# EAGLE design lodev-s76s (EAGLE 9.3.1)

## Sheet 1 of 2
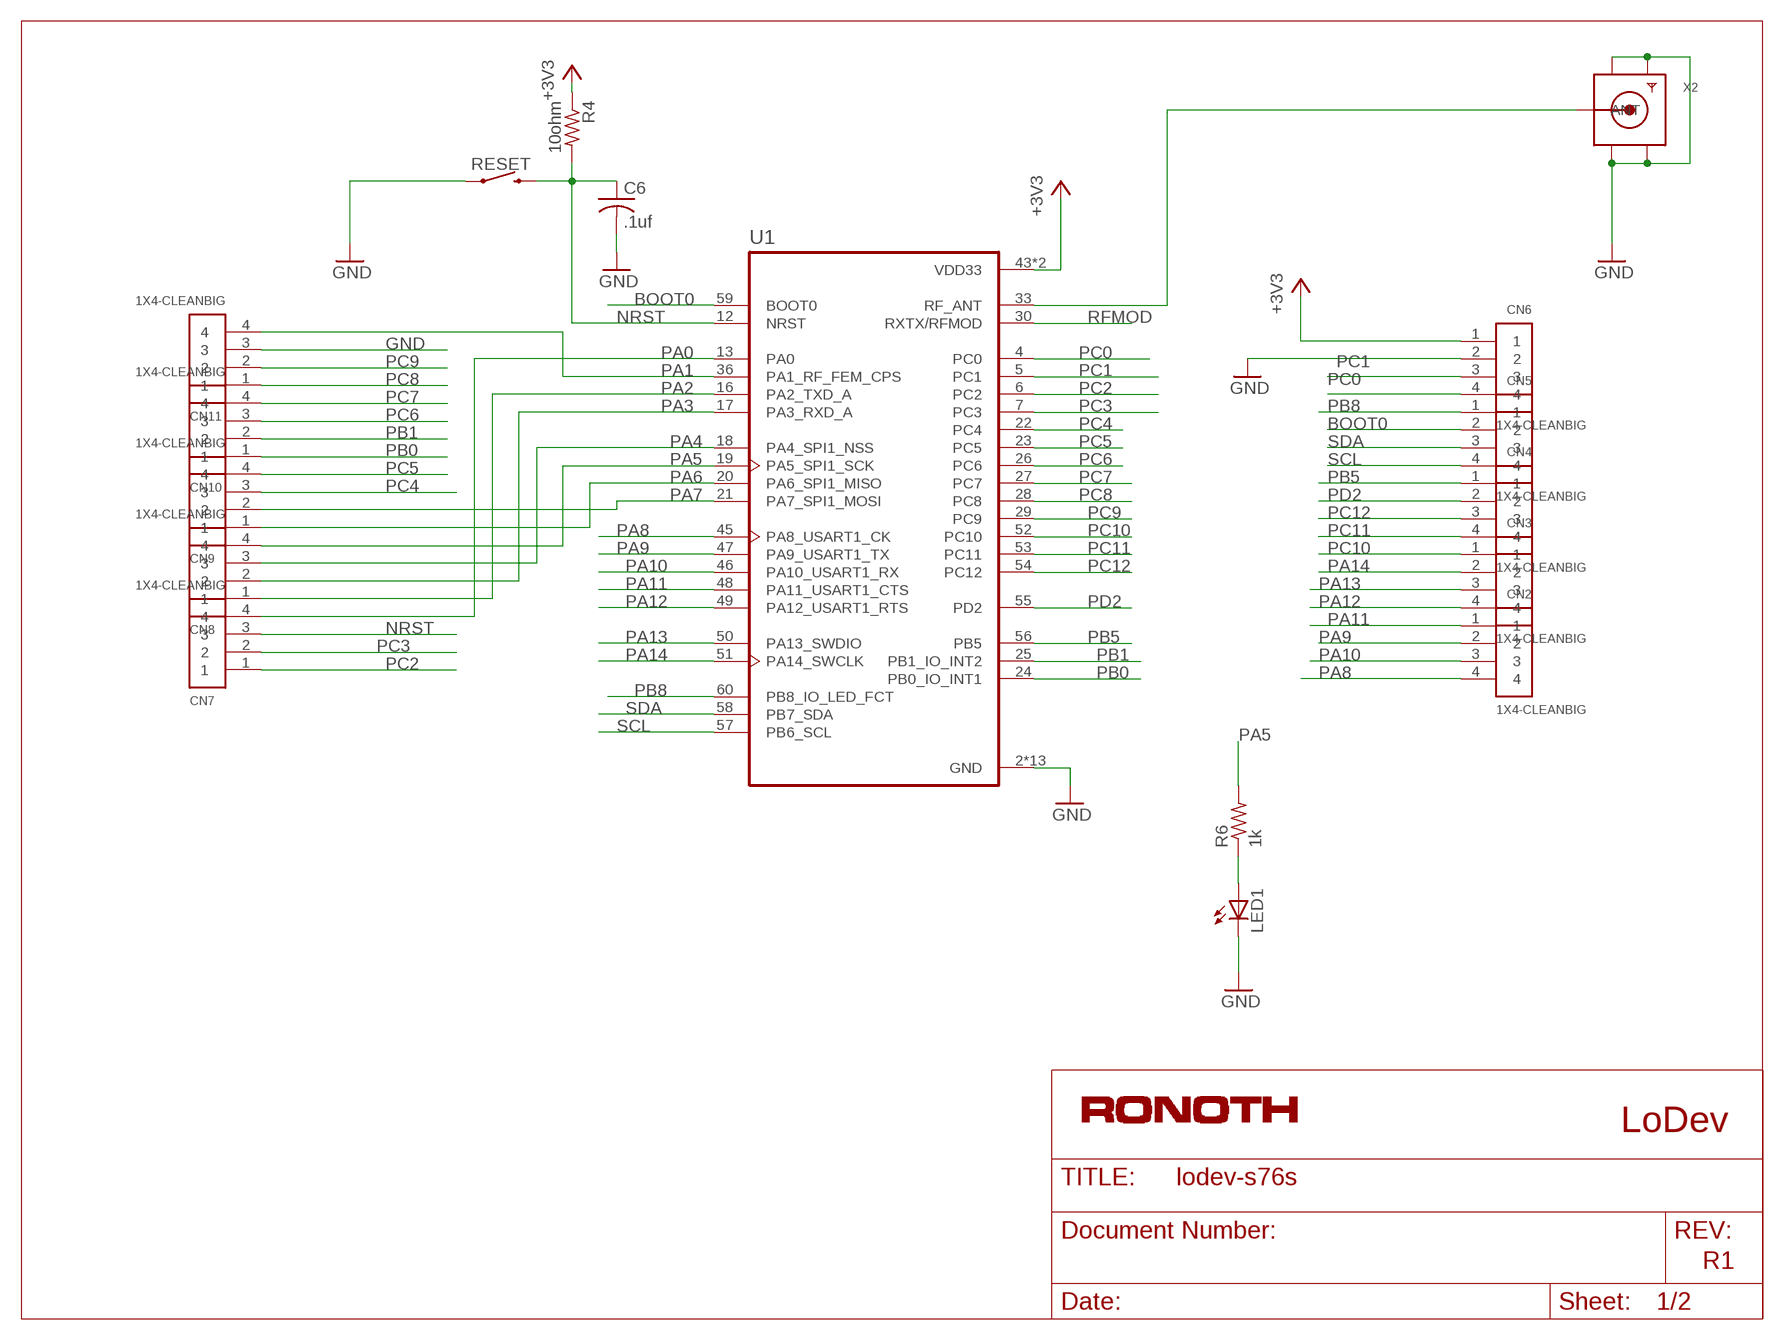
[diagram p0: schematic, sheet 1]

### Parts
C6  .1uf  C-USC0603K  [C0603K]
CN2  1X4-CLEANBIG  [1X04-CLEANBIG]
CN3  1X4-CLEANBIG  [1X04-CLEANBIG]
CN4  1X4-CLEANBIG  [1X04-CLEANBIG]
CN5  1X4-CLEANBIG  [1X04-CLEANBIG]
CN6  1X4-CLEANBIG  [1X04-CLEANBIG]
CN7  1X4-CLEANBIG  [1X04-CLEANBIG]
CN8  1X4-CLEANBIG  [1X04-CLEANBIG]
CN9  1X4-CLEANBIG  [1X04-CLEANBIG]
CN10  1X4-CLEANBIG  [1X04-CLEANBIG]
CN11  1X4-CLEANBIG  [1X04-CLEANBIG]
LED1  LEDCHIPLED_0603  [CHIPLED_0603]
R4  10ohm  R-US_R0603  [R0603]
R6  1k  R-US_R0603  [R0603]
RESET  MOMENTARY-SWITCH-SPST-SMD-6.0X3.5MM  [TACTILE_SWITCH_SMD_6.0X3.5MM]
U1  S76S  [ACSIP_S76S]
X2  SMACONNECTOR_EDGE  [SMA_EDGELAUNCH]

### Nets
+3V3: CN6.1 R4.1 U1.43(VDD33) U1.44(VDD33) ; also sheet 2
BOOT0: CN5.2 U1.59(BOOT0)
GND: C6.2 CN6.2 CN11.3 LED1.C RESET.1 U1.2(GND) U1.3(GND) U1.14(GND) U1.15(GND) U1.31(GND) U1.32(GND) U1.34(GND) U1.35(GND) U1.37(GND) U1.39(GND) U1.41(GND) U1.61(GND) U1.62(GND) X2.GND@1(GND4) X2.GND@2(GND3) X2.GND@3(GND2) X2.GND@4(GND1) ; also sheet 2
N$3: U1.33(RF_ANT) X2.P(ANT)
N$4: LED1.A R6.1
NRST: C6.1 CN7.3 R4.2 RESET.2 U1.12(NRST)
PA0: CN7.4 U1.13(PA0)
PA1: CN11.4 U1.36(PA1_RF_FEM_CPS)
PA2: CN8.1 U1.16(PA2_TXD_A)
PA3: CN8.2 U1.17(PA3_RXD_A)
PA4: CN8.3 U1.18(PA4_SPI1_NSS)
PA5: CN8.4 R6.2 U1.19(PA5_SPI1_SCK)
PA6: CN9.1 U1.20(PA6_SPI1_MISO)
PA7: CN9.2 U1.21(PA7_SPI1_MOSI)
PA8: CN2.4 U1.45(PA8_USART1_CK)
PA9: CN2.2 U1.47(PA9_USART1_TX) ; also sheet 2
PA10: CN2.3 U1.46(PA10_USART1_RX) ; also sheet 2
PA11: CN2.1 U1.48(PA11_USART1_CTS)
PA12: CN3.4 U1.49(PA12_USART1_RTS)
PA13: CN3.3 U1.50(PA13_SWDIO)
PA14: CN3.2 U1.51(PA14_SWCLK)
PB0: CN10.1 U1.24(PB0_IO_INT1)
PB1: CN10.2 U1.25(PB1_IO_INT2)
PB5: CN4.1 U1.56(PB5)
PB8: CN5.1 U1.60(PB8_IO_LED_FCT)
PC0: CN6.4 U1.4(PC0)
PC1: CN6.3 U1.5(PC1)
PC2: CN7.1 U1.6(PC2)
PC3: CN7.2 U1.7(PC3)
PC4: CN9.3 U1.22(PC4)
PC5: CN9.4 U1.23(PC5)
PC6: CN10.3 U1.26(PC6)
PC7: CN10.4 U1.27(PC7)
PC8: CN11.1 U1.28(PC8)
PC9: CN11.2 U1.29(PC9)
PC10: CN3.1 U1.52(PC10)
PC11: CN4.4 U1.53(PC11)
PC12: CN4.3 U1.54(PC12)
PD2: CN4.2 U1.55(PD2)
RFMOD: U1.30(RXTX/RFMOD)
SCL: CN5.4 U1.57(PB6_SCL)
SDA: CN5.3 U1.58(PB7_SDA)

### Notes on the sheet
- LoDev
- R1

## Sheet 2 of 2
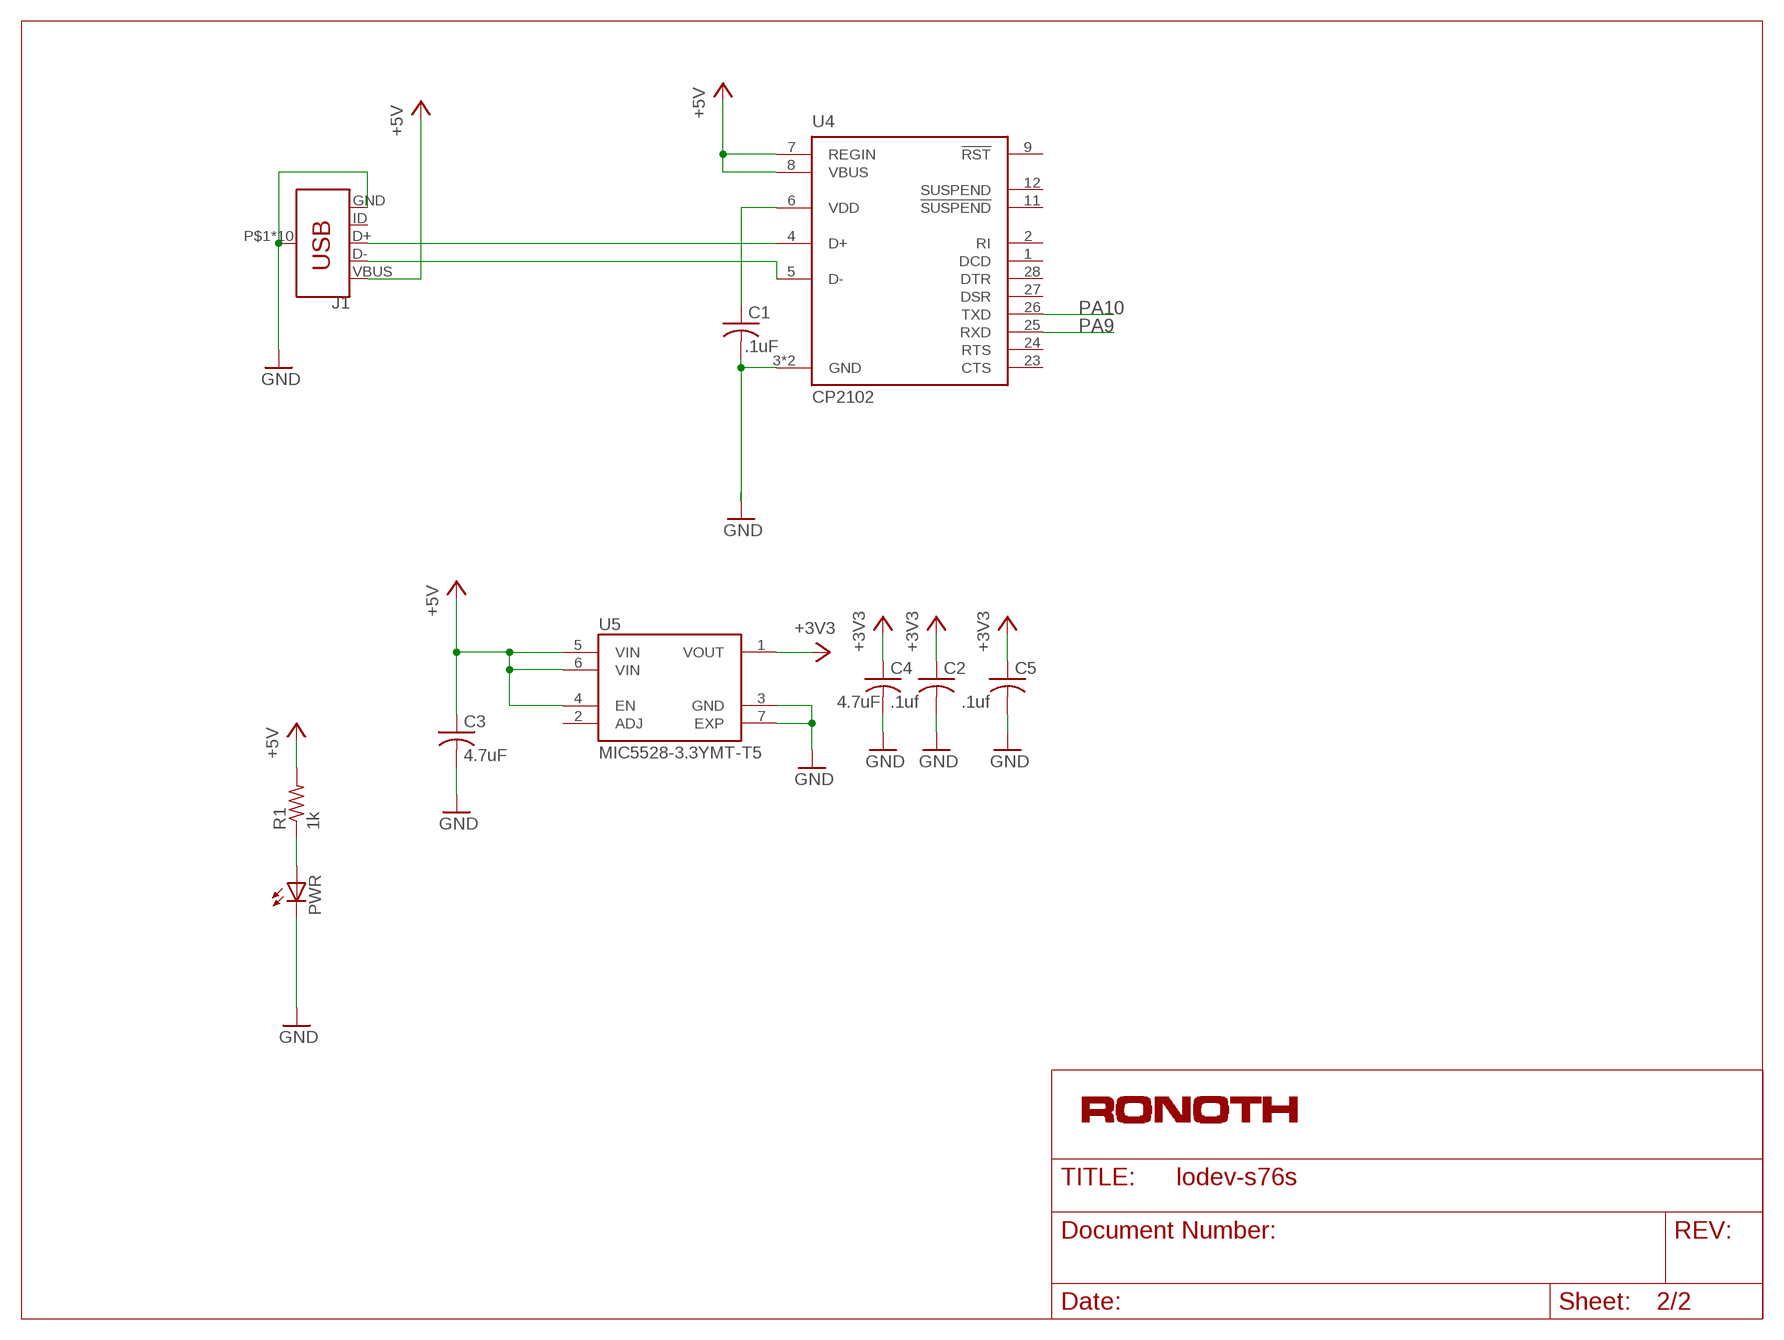
[diagram p1: schematic, sheet 2]

### Parts
C1  .1uF  C-USC0603K  [C0603K]
C2  .1uf  C-USC0603K  [C0603K]
C3  4.7uF  C-USC0603K  [C0603K]
C4  4.7uF  C-USC0603K  [C0603K]
C5  .1uf  C-USC0603K  [C0603K]
J1  USB_MICRO-B  [USB-MICROB-PTH]
PWR  LEDCHIPLED_0603  [CHIPLED_0603]
R1  1k  R-US_R0603  [R0603]
U4  CP2102  [MLP28]
U5  MIC5528-3.3YMT-T5  MIC94325YMT-TR  [SON50P160X160X60-7N]

### Nets
+3V3: C2.1 C4.1 C5.1 U5.1(VOUT) ; also sheet 1
+5V: C3.1 J1.VBUS R1.2 U4.7(REGIN) U4.8(VBUS) U5.4(EN) U5.5(VIN) U5.6(VIN)
D+: J1.D+ U4.4(D+)
D-: J1.D- U4.5(D-)
GND: C1.2 C2.2 C3.2 C4.2 C5.2 J1.GND J1.P$1(SHIELD) J1.P$3(SHIELD) J1.P$4(SHIELD) J1.P$8(SHIELD) J1.P$10(SHIELD) J1.P$12(SHIELD) J1.SHEILD2(SHIELD) J1.SHIELD J1.SHIELD3(SHIELD) J1.SHIELD4(SHIELD) PWR.C U4.3(GND) U4.EXP(GND) U5.3(GND) U5.7(EXP) ; also sheet 1
N$1: PWR.A R1.1
N$5: C1.1 U4.6(VDD)
PA9: U4.25(RXD) ; also sheet 1
PA10: U4.26(TXD) ; also sheet 1
Unconnected: J1.ID U4.1(DCD) U4.2(RI) U4.9(!RST) U4.11(!SUSPEND) U4.12(SUSPEND) U4.23(CTS) U4.24(RTS) U4.27(DSR) U4.28(DTR) U5.2(ADJ)

## Library data of the parts
C1-C6 = adafruit:C-US: CAPACITOR, American symbol
CN2-CN11 = adafruit:1X4: 4-pin connector
J1 = bitsetters:USB_MICRO-B: USB Type Micro-B Connector Male/female and PTH/SMT variants SparkFun Products: SparkFun microB USB Breakout <https://www.sparkfun.com/products/12035> SparkFun USB microB Plug Breakout <https://www.sparkfun.com/products/10031> SparkFun ESP8266 Thing <https://www.sparkfun.com/products/13231>
LED1 PWR = adafruit:LED: LED OSRAM: - CHIPLED LG R971, LG N971, LY N971, LG Q971, LY Q971, LO R971, LY R971 LH N974, LH R974 LS Q976, LO Q976, LY Q976 LO Q996 - Hyper CHIPLED LW Q18S LB Q993, LB Q99A, LB R99A - SideLED LS A670, LO A670, LY A670, LG A670, LP A670 LB A673, LV A673, LT A673, LW A673 LH A674 LY A675 LS A676, LA A676, LO A676, LY A676, LW A676 LS A679, LY A679, LG A679 - Hyper Micro SIDELED® LS Y876, LA Y876, LO Y876, LY Y876 LT Y87S - SmartLED LW L88C, LW L88S LB L89C, LB L89S, LG L890 LS L89K, LO L89K, LY L89K LS L896, LA L896, LO L896, LY L896 - TOPLED LS T670, LO T670, LY T670, LG T670, LP T670 LSG T670, LSP T670, LSY T670, LOP T670, LYG T670 LG T671, LOG T671, LSG T671 LB T673, LV T673, LT T673, LW T673 LH T674 LS T676, LA T676, LO T676, LY T676, LB T676, LH T676, LSB T676, LW T676 LB T67C, LV T67C, LT T67C, LS T67K, LO T67K, LY T67K, LW E67C LS E67B, LA E67B, LO E67B, LY E67B, LB E67C, LV E67C, LT E67C LW T67C LS T679, LY T679, LG T679 LS T770, LO T770, LY T770, LG T770, LP T770 LB T773, LV T773, LT T773, LW T773 LH T774 LS E675, LA E675, LY E675, LS T675 LS T776, LA T776, LO T776, LY T776, LB T776 LHGB T686 LT T68C, LB T68C - Hyper Mini TOPLED® LB M676 - Mini TOPLED Santana® LG M470 LS M47K, LO M47K, LY M47K Source: http://www.osram.convergy.de/
R1 R4 R6 = adafruit:R-US_: RESISTOR, American symbol
RESET = SparkFun-Switches:MOMENTARY-SWITCH-SPST: Momentary Switch (Pushbutton) - SPST Normally-open (NO) SPST momentary switches (buttons, pushbuttons). Variants PTH-12MM - 12mm square, through-hole Momentary Pushbutton Switch - 12mm Square <https://www.sparkfun.com/products/9190> (COM-09190) PTH-6.0MM, PTH-6.0MM-KIT - 6.0mm square, through-hole Mini Pushbutton Switch <https://www.sparkfun.com/products/97> (COM-00097) KIT package intended for soldering kit's - only one side of pads' copper is exposed. PTH-RIGHT-ANGLE-KIT - Right-angle, through-hole Right Angle Tactile Button <https://www.sparkfun.com/products/10791> - Used on SparkFun BigTime Watch Kit <https://www.sparkfun.com/products/11734> SMD-12MM - 12mm square, surface-mount Tactile Button - SMD (12mm) <https://www.sparkfun.com/products/12993> (COM-12993) Used on SparkFun PicoBoard <https://www.sparkfun.com/products/11888> SMD-4.5MM - 4.5mm Square Trackball Switch Used on SparkFun Blackberry Trackballer Breakout <https://www.sparkfun.com/products/13169> SMD-4.6MMX2.8MM - 4.60mm x 2.80mm, surface mount Used on SparkFun SAMD21 Mini Breakout <https://www.sparkfun.com/products/13664> SMD-5.2MM, SMD-5.2-REDUNDANT - 5.2mm square, surface-mount Mini Pushbutton Switch - SMD <https://www.sparkfun.com/products/8720> (COM-08720) Used on Arduino Pro Mini <https://www.sparkfun.com/products/11114> REDUNDANT package connects both switch circuits together SMD-6.0X3.5MM - 6.0 x 3.5mm, surface mount Momentary Reset Switch SMD <https://www.sparkfun.com/products/8229> (COM-08229) SMD-6.2MM-TALL - 6.2mm square, surface mount Tactile Button - SMD (6mm) <https://www.sparkfun.com/products/12992> Used on SparkFun Digital Sandbox <https://www.sparkfun.com/products/12651> SMD-RIGHT-ANGLE - Right-angle, surface mount Used on SparkFun Block for Intel® Edison - Arduino <https://www.sparkfun.com/products/13036>; PROD_ID: SWCH-00815; SF_SKU: COM-08229
U1 = bitsetters:S76S; AVAILABILITY: Unavailable; MF: AcSIP; MP: S76s; PACKAGE: Package Analog Devices; PRICE: None
U4 = bitsetters:CP210*: Single-Chip USB to UART Bridge Source: www.silabs.com .. CP2101.pdf / cp2102.pdf; MF: FARNELL; MPN: CP2102-GM; OC_FARNELL: 9282130; OC_NEWARK: 30K5635
U5 = bitsetters:MIC94325YMT-TR: MIC94325 Series 3.6V 500 mA Adjustable LDO with Ripple Blocker Technology-TDFN-6; AVAILABILITY: Unavailable; DESCRIPTION: MIC94325 Series 3.6V 500 mA Adjustable LDO with Ripple Blocker Technology-TDFN-6; MF: Microchip; MP: MIC94325YMT-TR; PACKAGE: TDFN-6 Microchip; PRICE: None
X2 = bitsetters:SMACONNECTOR: SMA Connector 90° DIP SMA Connector, 50 Ohm (4UConnector: 07259)

## Board
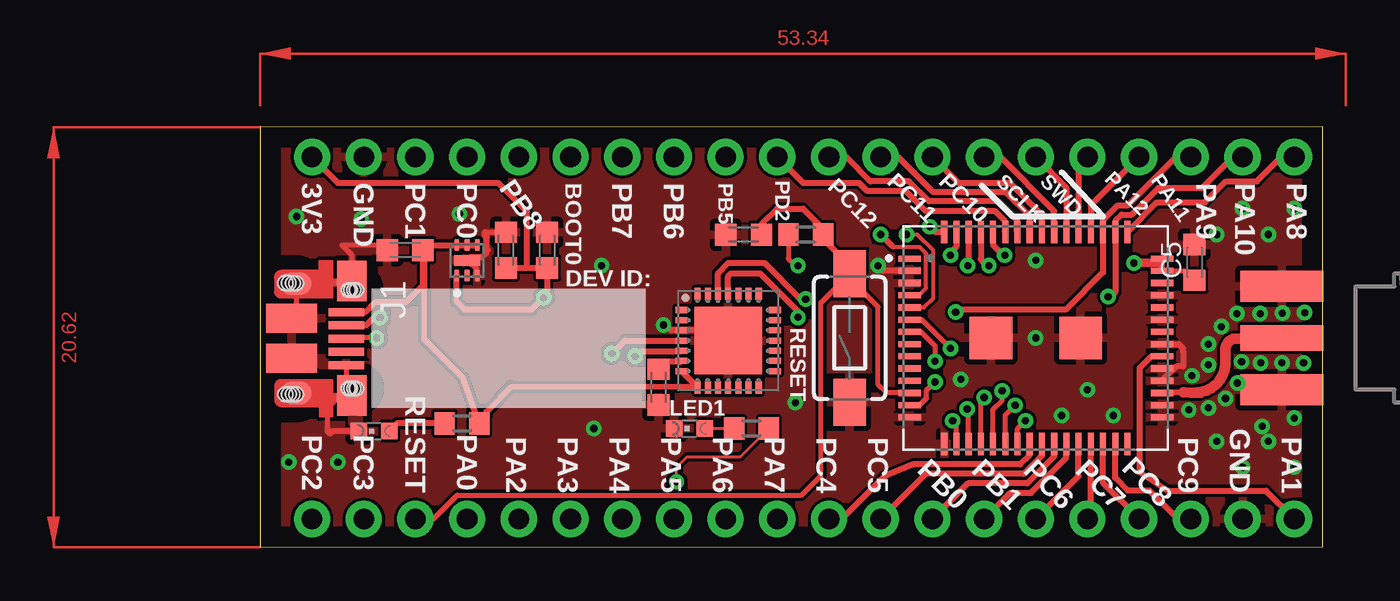
[diagram p2: board, top side]
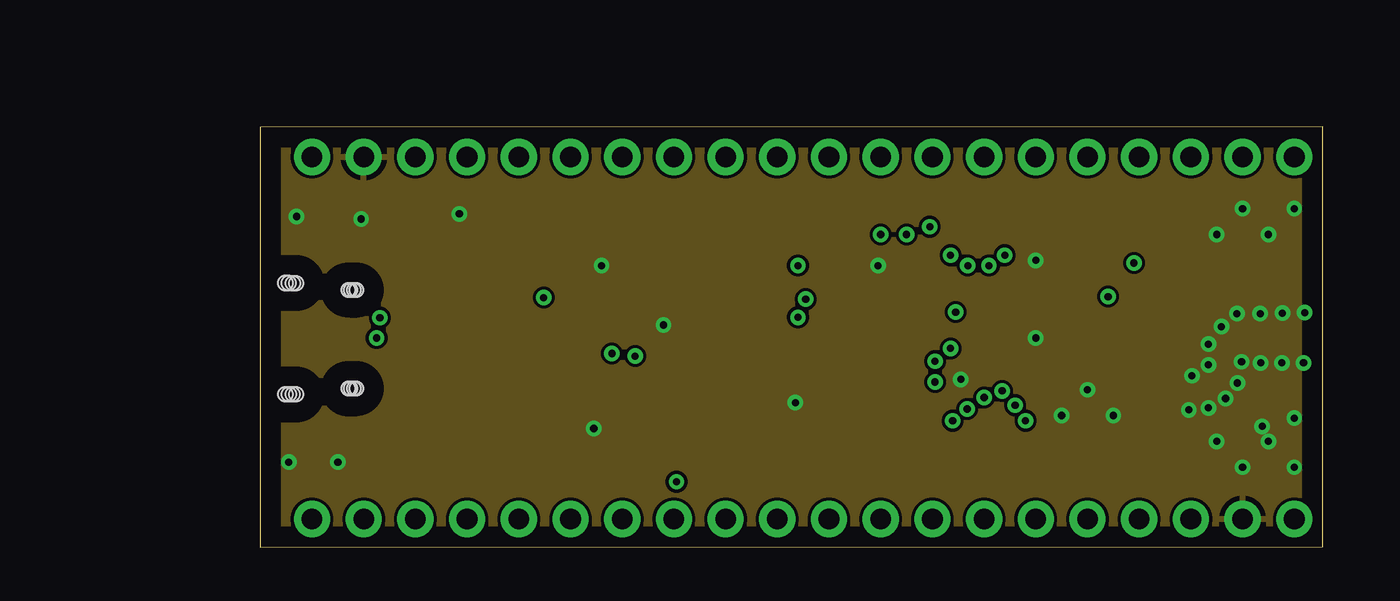
[diagram p3: board, inner layer Route2]
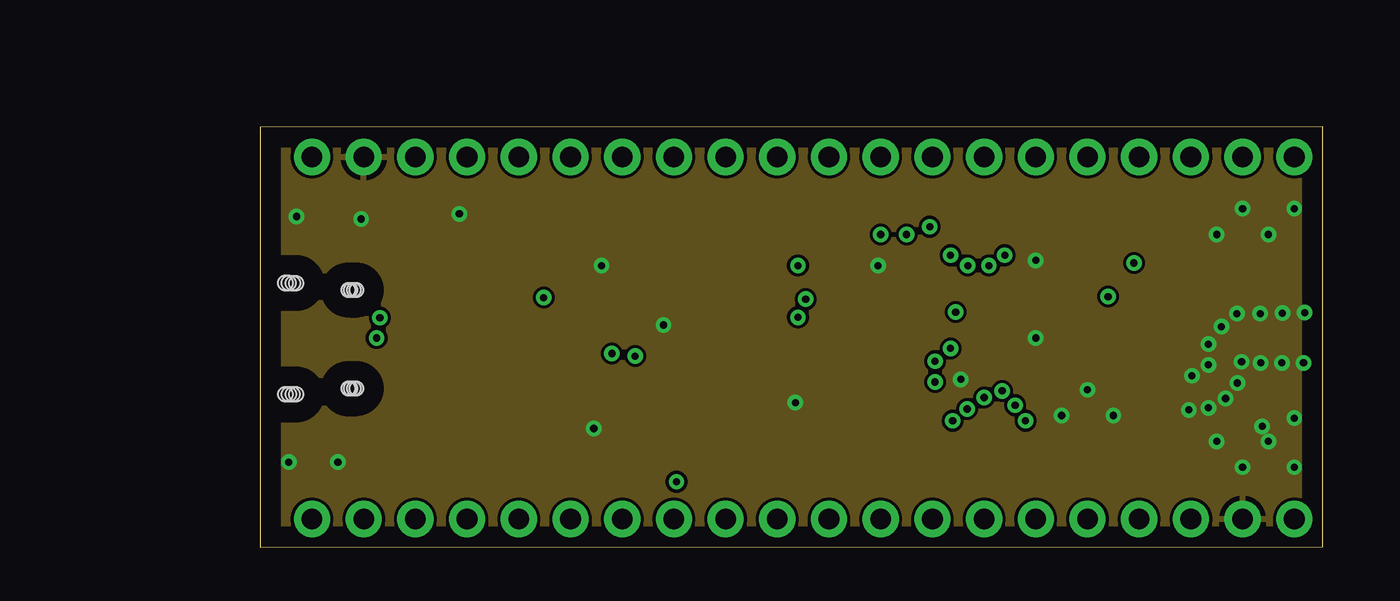
[diagram p4: board, inner layer Route15]
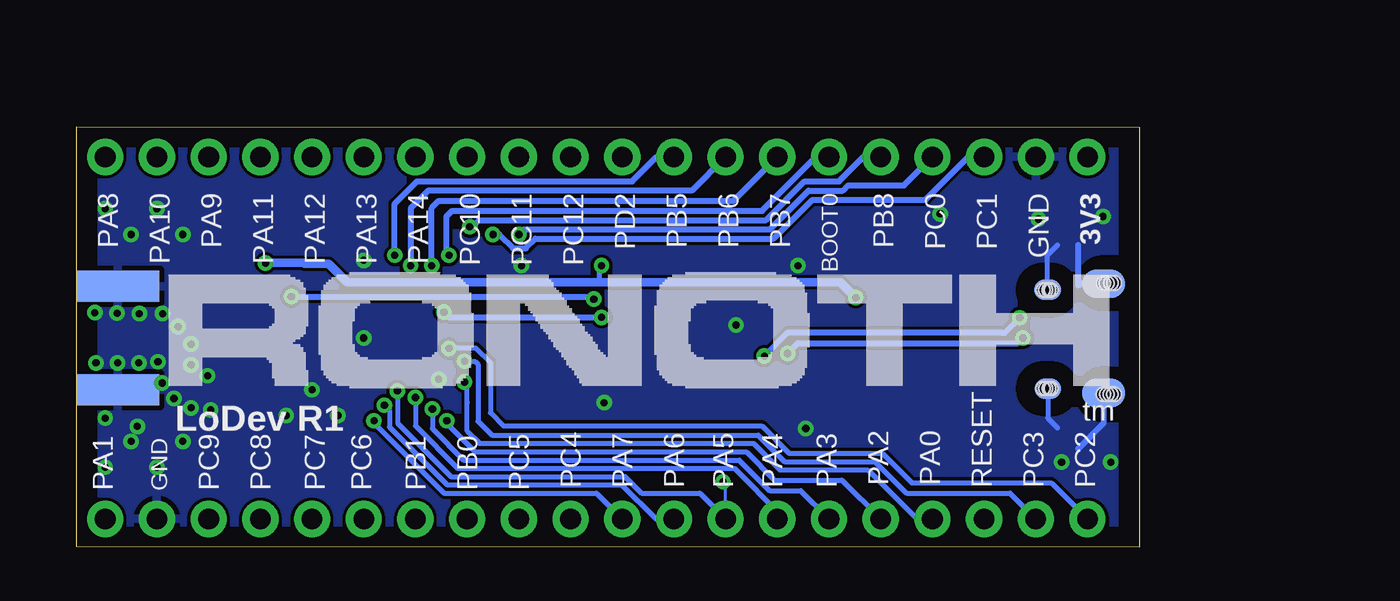
[diagram p5: board, bottom side, seen from below]

Size 52.2 x 20.65 mm. Coordinates in mm from the lower left corner, seen from the top.
Outline: 0,0 52.2,0.02 52.2,20.65 0,20.62 0,0
Copper layers (1*16): Top 0.035mm / dielectric 0.15mm / Bottom 0.035mm
Design rules "default *": minimum track width 6mil, minimum drill 0.35mm, track to track 6mil, track to pad 6mil, pad to pad 6mil, via to via 6mil, smd to smd 6mil, copper to edge 40mil, drill to drill 6mil, minimum pad ring 10mil, minimum via ring 8mil, stop-mask expansion 4mil, vias tented up to drill 15mil, thermal gap 10mil

### Footprints (pad centres in the part's own frame; a part is rotated, then mirrored left to right if it is on the bottom)
C0603K = smd 1.05 x 1.08: 1 -0.875,0; 2 0.875,0
1X04-CLEANBIG = drill 1.016 pad 1.778: 1 -3.81,0; 2 -1.27,0; 3 1.27,0; 4 3.81,0
USB-MICROB-PTH = smd 0.4 x 1.75: D+ 0.031,1.331; D- -0.619,1.331; GND 1.331,1.331; ID 0.681,1.331; VBUS -1.269,1.331 | smd 1.4 x 2.1 bottom: P$1 2.701,-1.142; P$3 -2.659,-1.144 | smd 1 x 1.3 bottom: P$4 -2.368,1.604; P$10 2.481,1.598 | smd 1.1 x 1.5: P$8 2.701,-1.142; P$12 -2.659,-1.144 | smd 2 x 1.46: SHEILD2 2.831,1.606; SHIELD -2.794,1.606 | smd 1.425 x 2.5: SHIELD3 -0.979,-1.349; SHIELD4 0.996,-1.352 | hole 0.7: -2.693,-1.134; -2.693,-1.3; -2.694,-1.499; -2.694,-1.664; 2.768,-1.134; 2.767,-1.303; 2.766,-1.496; 2.766,-1.664 | hole 0.66: -2.359,1.821; -2.349,1.691; -2.359,1.541; -2.354,1.432; 2.481,1.821; 2.491,1.691; 2.481,1.541; 2.486,1.432
CHIPLED_0603 = smd 0.8 x 0.8: A 0,-0.75; C 0,0.75
R0603 = smd 1 x 1.1: 1 -0.85,0; 2 0.85,0
TACTILE_SWITCH_SMD_6.0X3.5MM = smd 2.3 x 1.6: 1 -3.15,0; 2 3.15,0
ACSIP_S76S = smd 1.1 x 0.3: 1 -6.2,3.9; 2 -6.2,3.3; 3 -6.2,2.7; 4 -6.2,2.1; 5 -6.2,1.5; 6 -6.2,0.9; 7 -6.2,0.3; 8 -6.2,-0.3; 9 -6.2,-0.9; 10 -6.2,-1.5; 11 -6.2,-2.1; 12 -6.2,-2.7; 13 -6.2,-3.3; 14 -6.2,-3.9; 31 6.2,-3.9; 32 6.2,-3.3; 33 6.2,-2.7; 34 6.2,-2.1; 35 6.2,-1.5; 36 6.2,-0.9; 37 6.2,-0.3; 38 6.2,0.3; 39 6.2,0.9; 40 6.2,1.5; 41 6.2,2.1; 42 6.2,2.7; 43 6.2,3.3; 44 6.2,3.9 | smd 0.3 x 1.1: 15 -4.5,-5.2; 16 -3.9,-5.2; 17 -3.3,-5.2; 18 -2.7,-5.2; 19 -2.1,-5.2; 20 -1.5,-5.2; 21 -0.9,-5.2; 22 -0.3,-5.2; 23 0.3,-5.2; 24 0.9,-5.2; 25 1.5,-5.2; 26 2.1,-5.2; 27 2.7,-5.2; 28 3.3,-5.2; 29 3.9,-5.2; 30 4.5,-5.2; 45 4.5,5.2; 46 3.9,5.2; 47 3.3,5.2; 48 2.7,5.2; 49 2.1,5.2; 50 1.5,5.2; 51 0.9,5.2; 52 0.3,5.2; 53 -0.3,5.2; 54 -0.9,5.2; 55 -1.5,5.2; 56 -2.1,5.2; 57 -2.7,5.2; 58 -3.3,5.2; 59 -3.9,5.2; 60 -4.5,5.2 | smd 2.1 x 2.1: 61 -2.2,0; 62 2.2,0
MLP28 = smd 0.6 x 0.3: 1 -2.3,1.5; 2 -2.3,1; 3 -2.3,0.5; 4 -2.3,0; 5 -2.3,-0.5; 6 -2.3,-1; 7 -2.3,-1.5; 15 2.3,-1.5; 16 2.3,-1; 17 2.3,-0.5; 18 2.3,0; 19 2.3,0.5; 20 2.3,1; 21 2.3,1.5 | smd 0.3 x 0.6: 8 -1.5,-2.3; 9 -1,-2.3; 10 -0.5,-2.3; 11 0,-2.3; 12 0.5,-2.3; 13 1,-2.3; 14 1.5,-2.3; 22 1.5,2.3; 23 1,2.3; 24 0.5,2.3; 25 0,2.3; 26 -0.5,2.3; 27 -1,2.3; 28 -1.5,2.3 | smd 3.3 x 3.3: EXP 0,0
SON50P160X160X60-7N = smd 0.6 x 0.26: 1 -0.75,0.5; 2 -0.75,0; 3 -0.75,-0.5; 4 0.75,-0.5; 5 0.75,0; 6 0.75,0.5 | smd 0.5 x 1.26: 7 0,0
SMA_EDGELAUNCH = smd 4.064 x 1.524: GND@1 2.032,-2.54; GND@2 2.032,2.54 | smd 4.064 x 1.524 bottom: GND@3 2.032,2.54; GND@4 2.032,-2.54 | smd 4.064 x 1.27: P 2.032,0

### Placement (x,y rotation side)
C1  19.56,7.87 270 top
C2  12.06,14.6 90 top
C3  7.11,14.6 180 top
C4  14.1,14.6 90 top
C5  45.9,14 90 top
C6  23.75,15.37 180 top
CN2  46.99,19.18 0 top
CN3  36.83,19.18 0 top
CN4  26.67,19.18 0 top
CN5  16.51,19.18 0 top
CN6  6.35,19.18 0 top
CN7  6.35,1.4 0 top
CN8  16.51,1.4 0 top
CN9  26.67,1.4 0 top
CN10  36.83,1.4 0 top
CN11  46.99,1.4 0 top
J1  2.9,10.29 270 top
LED1  21.08,5.84 90 top
PWR  5.59,5.71 90 top
R1  9.91,6.1 0 top
R4  26.8,15.37 0 top
R6  24.13,5.84 0 top
RESET  28.96,10.29 90 top
U1  38.1,10.29 0 top
U4  22.99,10.16 0 top
U5  10.16,14.1 90 top
X2  52.22,10.29 180 top

### Tracks (layer width: path | path; a pad name or v marks a point on that pad's centre or on a via)
+3V3  (via drill 0.35)
  Top 0.203: 9.65,12.06 9.66,12.07
  Top 0.254: R4.1 25.95,14.18 26.16,13.97 26.29,13.97 v26.42,13.84 | U1.43 45.43,13.59 C5.1
  Top 0.305: 44.08,13.97 U1.44 U1.43 | C2.1 13.08,13.73 | 13.08,13.73 C4.1 14.1,12.45 v13.92,12.27 13.34,11.68 10.03,11.68 9.65,12.06 U5.1 | CN6.1 3.81,17.91 11.68,17.91 13.08,16.51 13.08,13.98 13.08,13.73
  Top 0.406: 44.08,13.97 v42.93,13.97
  Bottom 0.254: v26.42,13.84 26.54,13.72 26.54,13.03
  Bottom 0.406: v13.92,12.27 14.68,13.03 26.54,13.03 38.92,13.03 39.83,13.94 40.99,13.94 41.02,13.97 v42.93,13.97
+5V
  Top 0.152: 4.26,11.59 J1.VBUS
  Top 0.305: C3.1 8.23,14.85 U5.6 U5.5 U5.4 | C3.1 7.99,14.22 7.99,12.87 7.18,12.06 5.65,12.06 5.14,11.56 J1.VBUS | C3.1 8.04,14.55 8.04,10.25 9.72,8.57 9.96,8.32 R1.2 11.12,6.46 11.11,6.67 12.33,7.88 U4.8 U4.7
BOOT0  (via drill 0.35)
  Top 0.305: U1.59 34.2,14.77 33.91,14.48 v33.91,14.35
  Bottom 0.305: v33.91,14.35 34.04,14.48 34.04,16.26 33.76,16.54 18.53,16.54 15.89,19.18 CN5.2
D+  (via drill 0.35)
  Top 0.254: v5.71,10.29 4.26,10.29 J1.D+
  Top 0.305: v5.71,10.29 5.71,10.26 | v17.27,9.52 17.91,10.16 U4.4
  Bottom 0.305: v17.27,9.52 16.76,10.03 5.97,10.03 v5.71,10.29
D-  (via drill 0.35)
  Top 0.152: 5.19,10.91 J1.D-
  Top 0.305: 5.19,10.91 5.57,11.28 v5.87,11.28 | v18.41,9.4 18.63,9.62 20.64,9.62 U4.5
  Bottom 0.305: v5.87,11.28 6.61,10.54 6.73,10.54 17.27,10.54 v18.41,9.4
GND  (via drill 0.35)
  Top 0.152: U4.EXP 22.49,10.66
  Top 0.254: 3.3,5.86 3.3,6.74 | 3.3,6.74 3.2,6.85 3.3,6.74 | J1.P$8 1.88,7.46 3,7.46 3.3,7.15 | 3.3,7.15 3.3,6.86 | 3.3,6.86 3.3,6.74 | 3.3,6.86 3.9,7.46 4,7.46 | 4,7.46 J1.SHEILD2 | J1.P$12 3,12.95 | 3,12.95 4,12.95 | 4,12.95 4.37,12.95 | 4.37,12.95 J1.SHIELD | J1.GND 4.23,7.86 | 4.23,7.86 4.23,7.68 4,7.46 | J1.SHIELD 4.37,12.95 | 4.37,12.95 4,12.95 | 4,12.95 3,12.95 | 3,12.95 J1.P$12 | J1.SHIELD 4.5,14.35 | 4.5,14.35 4.5,14.36 | 4.5,14.36 4,14.86 5.99,14.86 C3.2 | J1.SHEILD2 4,7.46 | 4,7.46 3.6,7.46 3.3,7.15 | J1.SHIELD 4.5,14.35 | 4.5,14.35 4.5,14.36 | J1.SHIELD 3.13,13.08 3,12.95 | J1.SHEILD2 4,7.46 | J1.SHEILD2 4.23,7.73 4.23,7.86 | J1.P$12 1.75,11.47 J1.SHIELD3 | J1.SHIELD 4.37,12.95 | 4.37,12.95 4,12.95
  Top 0.305: U1.37 45.13,9.99 45.34,9.78 45.34,9.61 45.34,8.89 45,8.89 U1.34 | U1.2 30.61,13.59 v30.35,13.84 | v19.81,10.92 19.81,11.03 20.18,10.66 U4.3 22.49,10.66 | 3,7.46 1.78,7.46 | PWR.C 3.56,5.71 3.43,5.59 3.3,5.71 3.3,5.86 | U5.3 10.6,13.41 10.6,13.73 10.38,13.95 10.3,13.95 U5.7 10.3,14.24 10.88,14.24 11.1,14.46 11.1,14.52 11.18,14.6 11.12,14.66 11.12,15.21 11.05,15.28 11.05,15.49 C2.2
  Bottom 0.254: J1.P$10 4.49,6.35 4,5.86 | J1.P$4 4.5,14.36 4,14.86
  Bottom 0.305: J1.P$12 2.91,12.95 3,12.86 3,14.86 | J1.P$8 1.75,6.1 3,4.86
  other vias: 46.99,15.37 48.26,16.64 49.53,15.37 50.8,16.64 46.99,5.21 49.53,5.21 50.8,6.35 48.26,3.94 50.8,3.94 41.91,6.48 38.1,10.29 39.37,6.48 40.64,7.75 38.1,14.1 34.42,8.25 9.78,16.38 16.76,13.84 4.95,16.13 16.38,5.84 1.4,4.19 3.81,4.19 1.78,16.26 26.29,7.11 46.58,6.86 45.77,8.43 46.58,8.97 46.58,9.98 49.12,11.48 50.22,11.51 51.31,11.53 51.26,9.07 50.19,9.07 49.15,9.07 49.23,5.94 48.21,9.12 47.42,7.32 47.22,10.85 47.98,11.48 45.62,6.76 48.01,8.08
  pour Top: -5.08,21.72 -5.08,-1.14 55.88,-1.14 55.88,21.72
  pour Bottom: 0,21.72 0,-1.14 55.88,-1.14 55.88,21.72
  pour Top: 10.54,14.1 10.67,12.83 11.43,12.83 11.3,13.08 11.3,14.35
  pour Route2: 0,21.72 0,-1.14 55.88,-1.14 55.88,21.72
  pour Route15: 0,21.72 0,-1.14 55.88,-1.14 55.88,21.72
N$1
  Top 0.305: R1.1 6.72,6.1 PWR.A
N$3
  Top 0.254: X2.P 50.16,10.26 47.95,10.26
  Top 0.305: 45.34,7.62 U1.33
  Top 0.508: 46.2,7.59 45.76,7.6 | 45.76,7.6 45.34,7.62 | 45.76,7.6 45.93,7.6 arc90 47.42,9.09 47.42,9.73 arc-90 47.95,10.26 48.87,10.26 arc90 48.92,10.31
N$4
  Top 0.152: LED1.A R6.1
N$5
  Top 0.305: C1.1 19.56,9.12 20.64,9.12 U4.6
NRST
  Top 0.254: CN7.3 8.51,1.4 9.68,2.57 26.59,2.57 27.53,3.51 27.53,12.01 28.84,13.32 | 28.84,13.32 RESET.2 | U1.12 30.77,7.59 30.35,8 30.35,11.81 28.84,13.32
  Top 0.305: RESET.2 28.96,13.84 27.65,15.15 R4.2 27.67,15.39 27.67,15.63 26.67,16.64 25.4,16.64 24.62,15.86 C6.1
PA0  (via drill 0.35)
  Top 0.254: U1.13 32.4,6.99 32.73,7.32 32.73,7.71 v33.15,8.13
  Bottom 0.254: CN7.4 10.92,1.4 13.34,3.81 17.65,3.81 18.95,5.11 32.41,5.11 33.02,5.71 33.02,7.11 33.02,8 v33.15,8.13
PA1
  Top 0.305: U1.36 43.77,9.39 43.19,8.81 43.19,3.72 44.58,2.79 49.4,2.79 CN11.4
PA2  (via drill 0.35)
  Top 0.254: U1.16 34.2,6.03 34.02,6.21 v34.02,6.22
  Bottom 0.254: v34.02,6.22 34.02,6.08 32.63,4.7 19.3,4.7 17.91,3.3 14.61,3.3 CN8.1
PA3  (via drill 0.35)
  Top 0.254: U1.17 34.8,6.8 v34.73,6.8
  Bottom 0.254: v34.73,6.8 34.73,5.84 33.18,4.29 19.66,4.29 18.16,2.79 16.64,2.79 CN8.2
PA4  (via drill 0.35)
  Top 0.254: U1.18 35.4,7.21 v35.56,7.37
  Bottom 0.254: v35.56,7.37 35.56,5.97 33.48,3.89 19.89,3.89 17.59,1.59 CN8.3
PA5  (via drill 0.35)
  Top 0.152: v20.45,3.23 20.45,3.94 20.95,4.45 22.86,4.45 23.58,4.45 R6.2
  Top 0.254: U1.19 36,6.79 36.45,7.24 v36.45,7.69
  Bottom 0.152: CN8.4 20.32,3.1 v20.45,3.23
  Bottom 0.254: v36.45,7.69 36.45,7.37 36.42,7.34 36.42,6.1 33.81,3.48 25.26,3.48 24.44,2.67 21.59,2.67 CN8.4
PA6  (via drill 0.35)
  Top 0.254: U1.20 36.6,6.5 v37.08,6.99
  Bottom 0.254: v37.08,6.99 36.83,6.73 36.83,5.91 33.99,3.07 25.42,3.07 23.75,1.4 CN9.1
PA7  (via drill 0.35)
  Top 0.254: U1.21 37.2,5.83 v37.59,6.22
  Bottom 0.254: v37.59,6.22 37.59,6.1 34.16,2.67 26.67,2.67 CN9.2
PA8
  Top 0.305: CN2.4 50.16,19.18 48.97,17.98 47.45,17.98 46.41,16.94 44.06,16.94 U1.45
PA9  (via drill 0.35)
  Top 0.305: CN2.2 45,19.18 42.62,16.8 42.13,16.8 41.42,16.08 41.42,15.5 U1.47 41.4,13.51 39.58,11.68 34.16,11.68 v34.16,11.56 | v26.42,11.3 26.42,11.61 24.56,13.46 23.13,13.46 22.99,13.32 U4.25
  Bottom 0.305: v34.16,11.56 33.91,11.3 v26.42,11.3
PA10  (via drill 0.35)
  Top 0.305: CN2.3 47.8,19.18 46.26,17.65 44.11,17.65 42.81,16.34 42.32,16.34 42.02,16.04 42.02,15.5 U1.46 42,12.54 41.78,12.32 v41.66,12.32 | v26.8,12.19 26.54,12.19 24.77,13.97 22.99,13.97 22.49,13.47 U4.26
  Bottom 0.305: v41.66,12.32 26.92,12.32 v26.8,12.19
PA11
  Top 0.305: U1.48 40.8,16.8 CN2.1
PA12
  Top 0.305: U1.49 40.2,18.74 CN3.4
PA13
  Top 0.305: U1.50 39.6,17.68 CN3.3
PA14
  Top 0.305: U1.51 39,16.53 36.35,19.18 CN3.2
PB0
  Top 0.305: U1.24 39,4.46 37.68,3.14 34.77,3.14 CN10.1
PB1
  Top 0.305: CN10.2 36.84,2.68 37.86,2.68 39.6,4.42 U1.25
PB5  (via drill 0.35)
  Top 0.305: v36.58,14.35 36.52,14.41 36.45,14.41 36,14.86 U1.56
  Bottom 0.305: v36.58,14.35 36.58,16.89 35.48,17.98 24.91,17.98 23.71,19.18 CN4.1
PB8  (via drill 0.35)
  Top 0.305: U1.60 33.15,15.49 v32.89,15.75
  Bottom 0.305: v32.89,15.75 32.77,15.75 32.44,16.08 18.34,16.08 16.43,17.98 14.75,17.98 13.55,19.18 CN5.1
PC0  (via drill 0.35)
  Top 0.203: U1.4 31.96,12.33 32.3,12.33 32.7,12.73 32.7,14.44 32.41,14.73 31.11,14.73 31.05,14.8
  Top 0.305: 31.05,14.8 v30.48,15.37
  Bottom 0.305: v30.48,15.37 30.23,15.62 18.15,15.62 16.24,17.53 14.56,17.53 14.3,17.78 11.56,17.78 CN6.4
PC1  (via drill 0.35)
  Top 0.203: U1.5 32.62,11.79 33.06,12.23 33.06,14.59 32.28,15.37 v31.75,15.37
  Bottom 0.203: v31.75,15.37 31.45,15.37
  Bottom 0.305: 31.45,15.37 30.76,14.68 30.15,14.68 29.67,15.16 17.96,15.16 16.05,17.07 10.49,17.07 8.38,19.18 CN6.3
PC2  (via drill 0.35)
  Top 0.254: v33.91,9.78 32.5,11.19 U1.6
  Bottom 0.254: v33.91,9.78 33.88,9.8 32.6,9.8 31.88,9.08 31.88,6.6 31.24,5.97 18.54,5.97 17.2,4.62 12.62,4.62 11.18,3.17 4.32,3.17 CN7.1
PC3  (via drill 0.35)
  Top 0.254: U1.7 32.47,10.59 32.83,10.22 33.15,9.91 v33.15,9.14
  Bottom 0.254: v33.15,9.14 32.64,9.14 32.49,8.99 32.49,6.2 31.8,5.51 18.72,5.51 17.42,4.22 12.98,4.22 11.43,2.67 6.35,2.67 CN7.2
PC4
  Top 0.305: U1.22 37.8,4.56 37.33,4.08 32.1,4.08 30.67,3.49 28.57,1.4 CN9.3
PC5
  Top 0.305: U1.23 38.4,4.51 37.51,3.62 32.7,3.62 CN9.4
PC6
  Top 0.305: CN10.3 40.2,3.5 U1.26
PC7
  Top 0.305: CN10.4 40.8,1.56 U1.27
PC8
  Top 0.305: CN11.1 41.4,3.18 U1.28
PC9
  Top 0.305: CN11.2 45.09,1.4 43.69,2.79 42.62,2.79 42,3.41 U1.29
PC10
  Top 0.305: U1.52 38.4,16.34 36.83,17.91 34.29,17.91 CN3.1
PC11
  Top 0.305: U1.53 37.8,16.29 36.64,17.45 33.06,17.45 31.33,19.18 CN4.4
PC12
  Top 0.305: U1.54 37.18,15.5 37.18,16.08 36.27,16.99 32.87,16.99 31.88,17.98 29.99,17.98 28.79,19.18 CN4.3
PD2
  Top 0.305: U1.55 36.58,15.5 36.58,16.04 36.08,16.54 32.68,16.54 31.69,17.53 29.8,17.53 29.41,17.91 26.67,17.91 CN4.2
SCL  (via drill 0.35)
  Top 0.305: v35.79,13.84 35.69,13.84 35.44,14.09 35.44,14.13 35.4,14.17 U1.57
  Bottom 0.305: v35.79,13.84 35.79,16.66 34.92,17.53 21.97,17.53 CN5.4
SDA  (via drill 0.35)
  Top 0.305: U1.58 34.8,13.97 34.8,13.88 v34.76,13.84
  Bottom 0.305: v34.76,13.84 34.76,16.68 34.42,17.02 20.32,17.02 19.94,17.02 CN5.3
(copper drawn outside any net)
  shapes: Top area x2

### Text on the board
tNames: 3V3 | GND | PC1 | PC0 | PB8 | BOOT0 | PB7 | PB6 | PB5 | PD2 | PC12 | PC11 | PC10 | SCLK | SWD | PA12 | PA11 | PA9 | PA10 | PA8 | DEV ID: | PC2 | PC3 | RESET | PA0 | PA2 | PA3 | PA4 | PA5 | PA6 | PA7 | PC4 | PC5 | PC9 | GND | PA1 | PB0 | PB1 | PC6 | PC7 | PC8
bNames: 3V3 | GND | PC1 | PC0 | PB8 | BOOT0 | PB7 | PB6 | PB5 | PD2 | PC12 | PC11 | PC10 | PA14 | PA13 | PA12 | PA11 | PA9 | PA10 | PA8 | tm | LoDev R1 | PC2 | PC3 | RESET | PA0 | PA2 | PA3 | PA4 | PA5 | PA6 | PA7 | PC4 | PC5 | PB0 | PB1 | PC6 | PC7 | PC8 | PC9 | GND | PA1